# EAGLE schematic Enclosure 85x58 GPS (EAGLE 9.6.2)
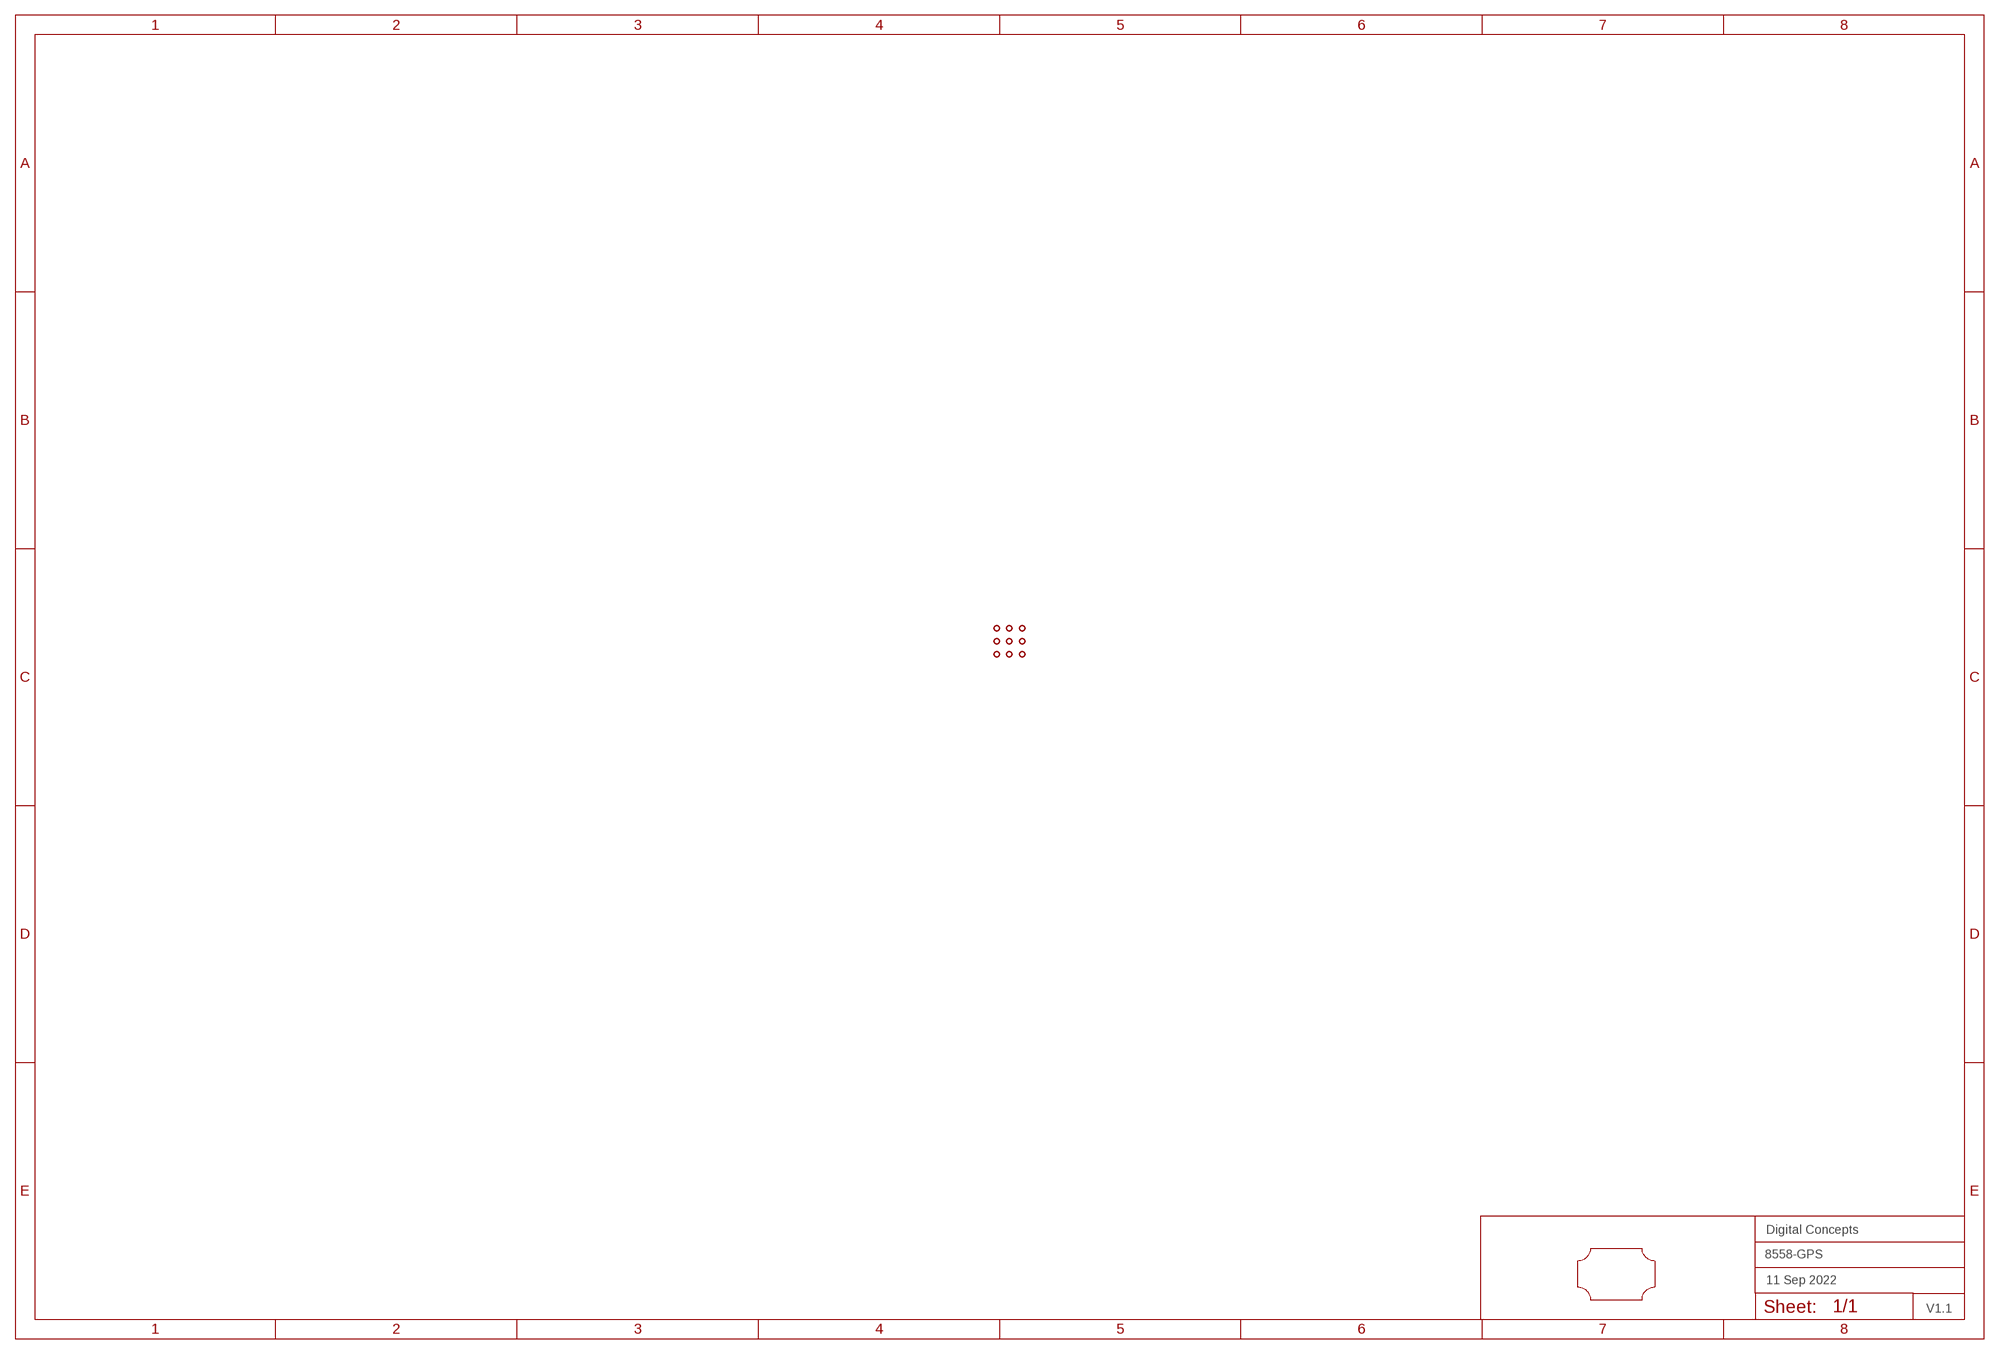
[diagram p0: schematic, sheet 1]
FRAME2 (A3L-LOC): DATE: 11 Sep 2022; OWNER: Digital Concepts; TITLE: 8558-GPS; VERSION: V1.1

## Parts
U$1  PROTO-28X18-GPS  [PROTO-28X18-GPS]
U$2  PCB-OUTLINE-A-85X58  [PROTO-28X18-OUTLINE-A]

## Library data of the parts
U$1 = digitalconcepts:PROTO-28X18-GPS: 28 x 18 Prototyping board to fit an 85 x 58 enclosure
U$2 = digitalconcepts:PCB-OUTLINE-A-85X58: PCB outline with hole blank for 85 x 58 enclosure